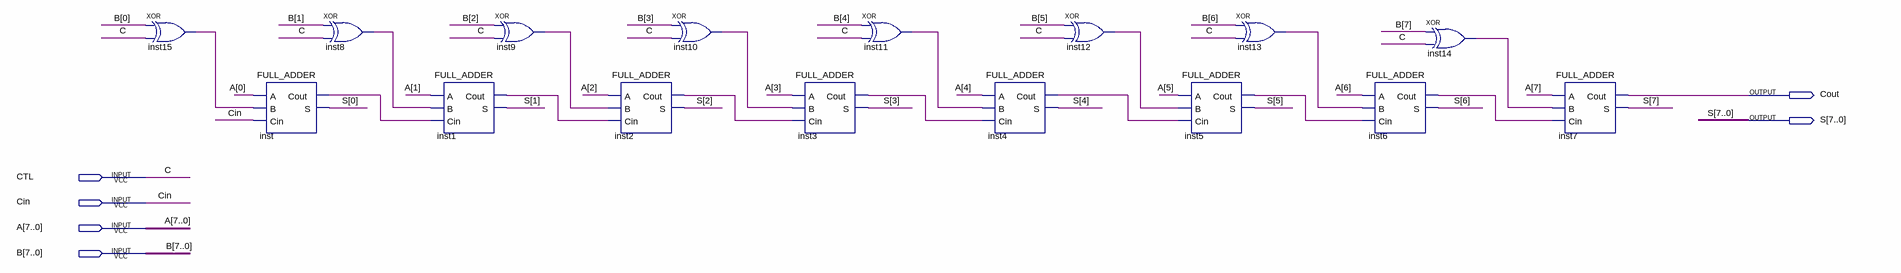
[diagram p0: schematic sheet]
// Quartus schematic ADDER_8_BIT.bdf as structural Verilog: 16 symbols, 6 pins
module ADDER_8_BIT (
  input  CTL,
  input  Cin,
  input  [7:0] A,
  input  [7:0] B,
  output Cout,
  output [7:0] S
);

  wire inst1_cout, inst2_cout, inst3_cout, inst4_cout, inst5_cout, inst6_cout, inst8_out, inst9_out,
       inst10_out, inst11_out, inst12_out, inst13_out, inst14_out, inst15_out, inst_cout;

  xor inst15 (inst15_out, B[0], CTL);
  FULL_ADDER inst (.A(A[0]), .B(inst15_out), .Cin(Cin), .Cout(inst_cout), .S(S[0]));
  xor inst8 (inst8_out, B[1], CTL);
  FULL_ADDER inst1 (.A(A[1]), .B(inst8_out), .Cin(inst_cout), .Cout(inst1_cout), .S(S[1]));
  xor inst9 (inst9_out, B[2], CTL);
  FULL_ADDER inst2 (.A(A[2]), .B(inst9_out), .Cin(inst1_cout), .Cout(inst2_cout), .S(S[2]));
  xor inst10 (inst10_out, B[3], CTL);
  FULL_ADDER inst3 (.A(A[3]), .B(inst10_out), .Cin(inst2_cout), .Cout(inst3_cout), .S(S[3]));
  xor inst11 (inst11_out, B[4], CTL);
  FULL_ADDER inst4 (.A(A[4]), .B(inst11_out), .Cin(inst3_cout), .Cout(inst4_cout), .S(S[4]));
  xor inst12 (inst12_out, B[5], CTL);
  FULL_ADDER inst5 (.A(A[5]), .B(inst12_out), .Cin(inst4_cout), .Cout(inst5_cout), .S(S[5]));
  xor inst13 (inst13_out, B[6], CTL);
  FULL_ADDER inst6 (.A(A[6]), .B(inst13_out), .Cin(inst5_cout), .Cout(inst6_cout), .S(S[6]));
  xor inst14 (inst14_out, B[7], CTL);
  FULL_ADDER inst7 (.A(A[7]), .B(inst14_out), .Cin(inst6_cout), .Cout(Cout), .S(S[7]));

  // Other names for the same wires on the sheet: C = CTL
endmodule
